# Altium schematic sheet Schematics.SchDoc
size A3; SheetTotal: 20
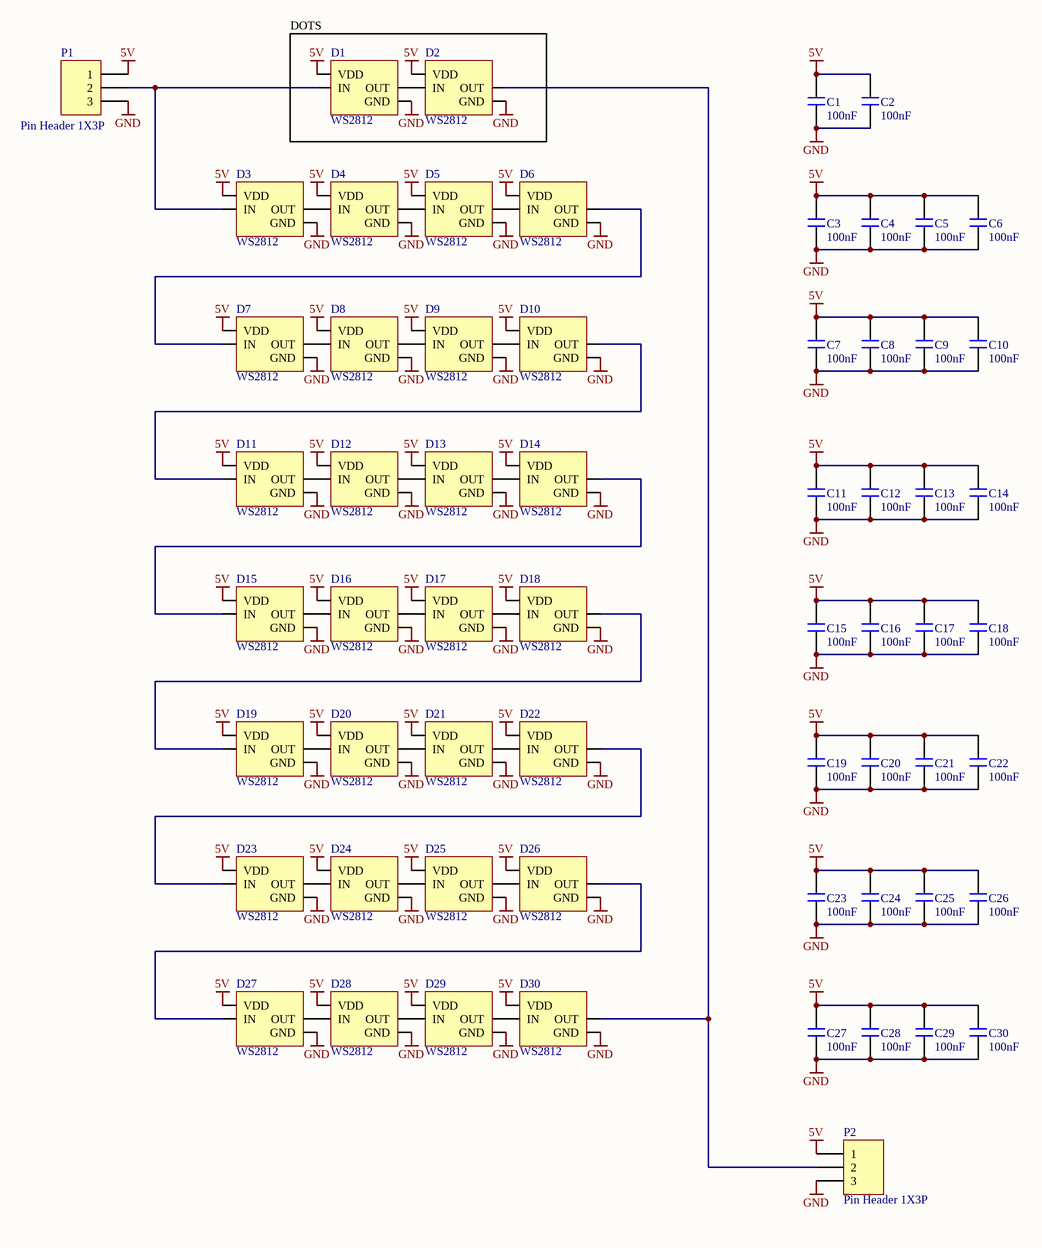
[diagram p0: Schematics.SchDoc]

## Parts
C1  100nF  [EM-0805-C T1,25_SMD]
C2  100nF  [EM-0805-C T1,25_SMD]
C3  100nF  [EM-0805-C T1,25_SMD]
C4  100nF  [EM-0805-C T1,25_SMD]
C5  100nF  [EM-0805-C T1,25_SMD]
C6  100nF  [EM-0805-C T1,25_SMD]
C7  100nF  [EM-0805-C T1,25_SMD]
C8  100nF  [EM-0805-C T1,25_SMD]
C9  100nF  [EM-0805-C T1,25_SMD]
C10  100nF  [EM-0805-C T1,25_SMD]
C11  100nF  [EM-0805-C T1,25_SMD]
C12  100nF  [EM-0805-C T1,25_SMD]
C13  100nF  [EM-0805-C T1,25_SMD]
C14  100nF  [EM-0805-C T1,25_SMD]
C15  100nF  [EM-0805-C T1,25_SMD]
C16  100nF  [EM-0805-C T1,25_SMD]
C17  100nF  [EM-0805-C T1,25_SMD]
C18  100nF  [EM-0805-C T1,25_SMD]
C19  100nF  [EM-0805-C T1,25_SMD]
C20  100nF  [EM-0805-C T1,25_SMD]
C21  100nF  [EM-0805-C T1,25_SMD]
C22  100nF  [EM-0805-C T1,25_SMD]
C23  100nF  [EM-0805-C T1,25_SMD]
C24  100nF  [EM-0805-C T1,25_SMD]
C25  100nF  [EM-0805-C T1,25_SMD]
C26  100nF  [EM-0805-C T1,25_SMD]
C27  100nF  [EM-0805-C T1,25_SMD]
C28  100nF  [EM-0805-C T1,25_SMD]
C29  100nF  [EM-0805-C T1,25_SMD]
C30  100nF  [EM-0805-C T1,25_SMD]
D1  WS2812  [WS2812B]
D2  WS2812  [WS2812B]
D3  WS2812  [WS2812B]
D4  WS2812  [WS2812B]
D5  WS2812  [WS2812B]
D6  WS2812  [WS2812B]
D7  WS2812  [WS2812B]
D8  WS2812  [WS2812B]
D9  WS2812  [WS2812B]
D10  WS2812  [WS2812B]
D11  WS2812  [WS2812B]
D12  WS2812  [WS2812B]
D13  WS2812  [WS2812B]
D14  WS2812  [WS2812B]
D15  WS2812  [WS2812B]
D16  WS2812  [WS2812B]
D17  WS2812  [WS2812B]
D18  WS2812  [WS2812B]
D19  WS2812  [WS2812B]
D20  WS2812  [WS2812B]
D21  WS2812  [WS2812B]
D22  WS2812  [WS2812B]
D23  WS2812  [WS2812B]
D24  WS2812  [WS2812B]
D25  WS2812  [WS2812B]
D26  WS2812  [WS2812B]
D27  WS2812  [WS2812B]
D28  WS2812  [WS2812B]
D29  WS2812  [WS2812B]
D30  WS2812  [WS2812B]
P1  Pin Header 1X3P  [CON Header 1X3]
P2  Pin Header 1X3P  [CON Header 1X3]

## Blocks framed on the sheet
DOTS: D1 D2

## Nets
5V: C1.2 C2.2 C3.2 C4.2 C5.2 C6.2 C7.2 C8.2 C9.2 C10.2 C11.2 C12.2 C13.2 C14.2 C15.2 C16.2 C17.2 C18.2 C19.2 C20.2 C21.2 C22.2 C23.2 C24.2 C25.2 C26.2 C27.2 C28.2 C29.2 C30.2 D1.1(VDD) D2.1(VDD) D3.1(VDD) D4.1(VDD) D5.1(VDD) D6.1(VDD) D7.1(VDD) D8.1(VDD) D9.1(VDD) D10.1(VDD) D11.1(VDD) D12.1(VDD) D13.1(VDD) D14.1(VDD) D15.1(VDD) D16.1(VDD) D17.1(VDD) D18.1(VDD) D19.1(VDD) D20.1(VDD) D21.1(VDD) D22.1(VDD) D23.1(VDD) D24.1(VDD) D25.1(VDD) D26.1(VDD) D27.1(VDD) D28.1(VDD) D29.1(VDD) D30.1(VDD) P1.1 P2.1
GND: C1.1 C2.1 C3.1 C4.1 C5.1 C6.1 C7.1 C8.1 C9.1 C10.1 C11.1 C12.1 C13.1 C14.1 C15.1 C16.1 C17.1 C18.1 C19.1 C20.1 C21.1 C22.1 C23.1 C24.1 C25.1 C26.1 C27.1 C28.1 C29.1 C30.1 D1.3(GND) D2.3(GND) D3.3(GND) D4.3(GND) D5.3(GND) D6.3(GND) D7.3(GND) D8.3(GND) D9.3(GND) D10.3(GND) D11.3(GND) D12.3(GND) D13.3(GND) D14.3(GND) D15.3(GND) D16.3(GND) D17.3(GND) D18.3(GND) D19.3(GND) D20.3(GND) D21.3(GND) D22.3(GND) D23.3(GND) D24.3(GND) D25.3(GND) D26.3(GND) D27.3(GND) D28.3(GND) D29.3(GND) D30.3(GND) P1.3 P2.3
NetD1_2: D1.2(OUT) D2.4(IN)
NetD1_4: D1.4(IN) D3.4(IN) P1.2
NetD2_2: D2.2(OUT) D30.2(OUT) P2.2
NetD3_2: D3.2(OUT) D4.4(IN)
NetD4_2: D4.2(OUT) D5.4(IN)
NetD5_2: D5.2(OUT) D6.4(IN)
NetD6_2: D6.2(OUT) D7.4(IN)
NetD7_2: D7.2(OUT) D8.4(IN)
NetD8_2: D8.2(OUT) D9.4(IN)
NetD9_2: D9.2(OUT) D10.4(IN)
NetD10_2: D10.2(OUT) D11.4(IN)
NetD11_2: D11.2(OUT) D12.4(IN)
NetD12_2: D12.2(OUT) D13.4(IN)
NetD13_2: D13.2(OUT) D14.4(IN)
NetD14_2: D14.2(OUT) D15.4(IN)
NetD15_2: D15.2(OUT) D16.4(IN)
NetD16_2: D16.2(OUT) D17.4(IN)
NetD17_2: D17.2(OUT) D18.4(IN)
NetD18_2: D18.2(OUT) D19.4(IN)
NetD19_2: D19.2(OUT) D20.4(IN)
NetD20_2: D20.2(OUT) D21.4(IN)
NetD21_2: D21.2(OUT) D22.4(IN)
NetD22_2: D22.2(OUT) D23.4(IN)
NetD23_2: D23.2(OUT) D24.4(IN)
NetD24_2: D24.2(OUT) D25.4(IN)
NetD25_2: D25.2(OUT) D26.4(IN)
NetD26_2: D26.2(OUT) D27.4(IN)
NetD27_2: D27.2(OUT) D28.4(IN)
NetD28_2: D28.2(OUT) D29.4(IN)
NetD29_2: D29.2(OUT) D30.4(IN)

## Notes on the sheet
- Title
- Size:
- Date:
- A3
- Number:
- Time:
- Revision:
- Sheet
- of
- File:

## Library data of the parts
C1-C30 = Capacitor: Manufacturer Name: Farnell; Tolerance: +-5%; Diëlectricum: X7R; Unit Price (€): 0.1; Value: 100nF
P1 P2 = Pin Header 3: Header 3-Pin; Type: Pin Header 1x3P; Value: Pin Header 1x3P; Unit Price (€): ?